# EAGLE design lm317 (EAGLE 9.5.0)
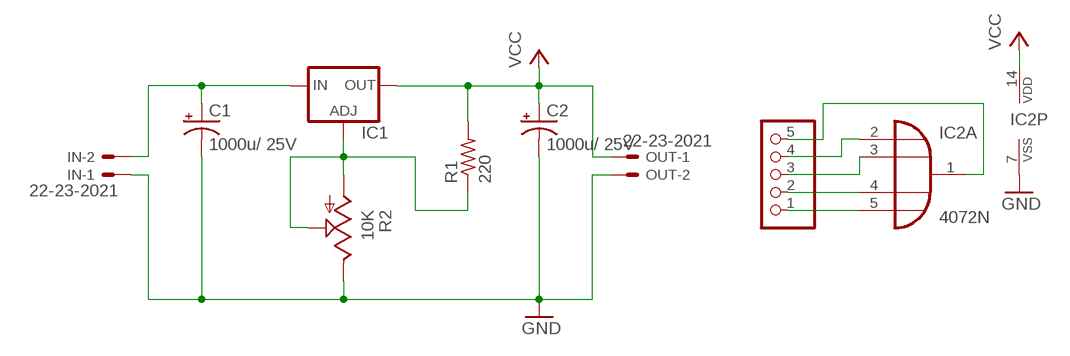
[diagram p0: schematic, sheet 1]

## Parts
C1  1000u/ 25V  CPOL-USE5-8.5  [E5-8,5]
C2  1000u/ 25V  CPOL-USE5-8.5  [E5-8,5]
IC1  LM317TS  [317TS]
IC2  4072N  [DIL14]
IN  22-23-2021  [22-23-2021]
JP1  PINHD-1X5  [1X05]
OUT  22-23-2021  [22-23-2021]
R1  220  R-US_0207/10  [0207/10]
R2  10K  TRIM_US-CA6V  [CA6V]

## Nets
GND: C1.- C2.- IC2.7(P:VSS) IN.1 OUT.2 R2.E
N$1: C1.+ IC1.3(IN) IN.2
N$2: IC2.1(A:O) JP1.5
N$3: IC1.1(ADJ) R1.1 R2.A R2.S
N$4: IC2.2(A:I0) JP1.4
N$5: IC2.3(A:I1) JP1.3
N$6: IC2.4(A:I2) JP1.2
N$7: IC2.5(A:I3) JP1.1
VCC: C2.+ IC1.2(OUT) IC2.14(P:VDD) OUT.1 R1.2
Unconnected: IC2.9(B:I0) IC2.10(B:I1) IC2.11(B:I2) IC2.12(B:I3) IC2.13(B:O)

## Library data of the parts
C1 C2 = rcl:CPOL-US: POLARIZED CAPACITOR, American symbol; SPICEPREFIX: C
IC1 = v-reg:LM317TS: VOLTAGE REGULATOR
IC2 = 40xx:4072: Dual 4-input OR
IN OUT = con-molex:22-23-2021: .100" (2.54mm) Center Header - 2 Pin; MF: MOLEX; MPN: 22-23-2021; OC_FARNELL: 1462926; OC_NEWARK: 25C3832
JP1 = pinhead:PINHD-1X5: PIN HEADER
R1 = rcl:R-US_: RESISTOR, American symbol; SPICEPREFIX: R
R2 = pot:TRIM_US-: POTENTIOMETER

## Board
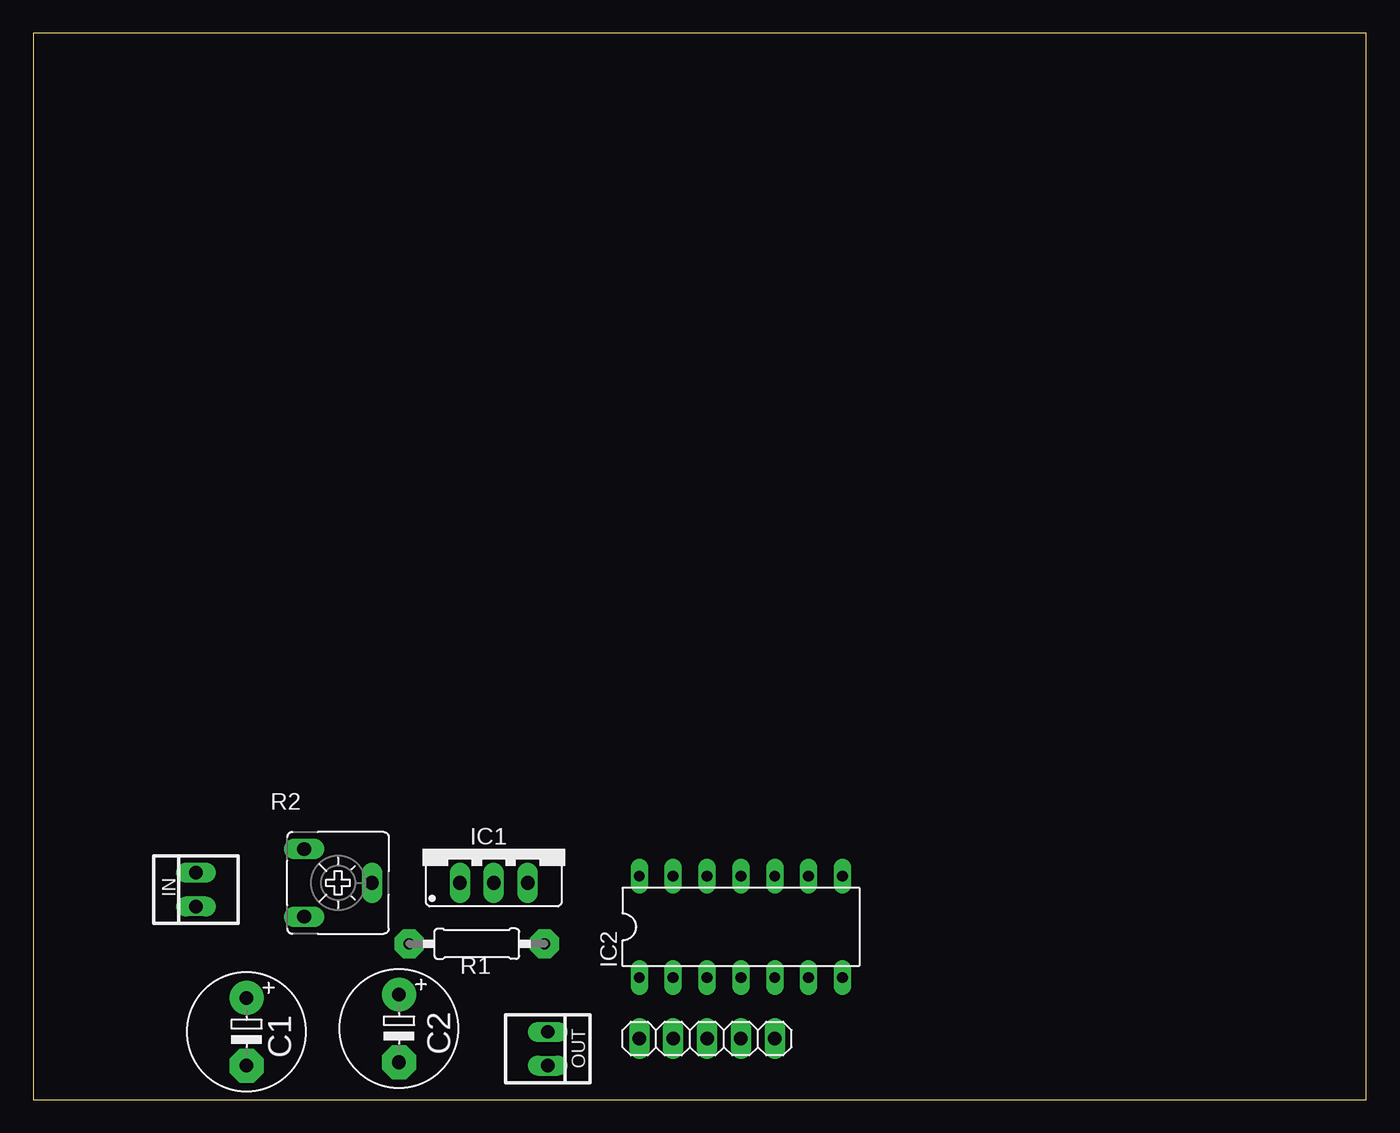
[diagram p1: board, top side]
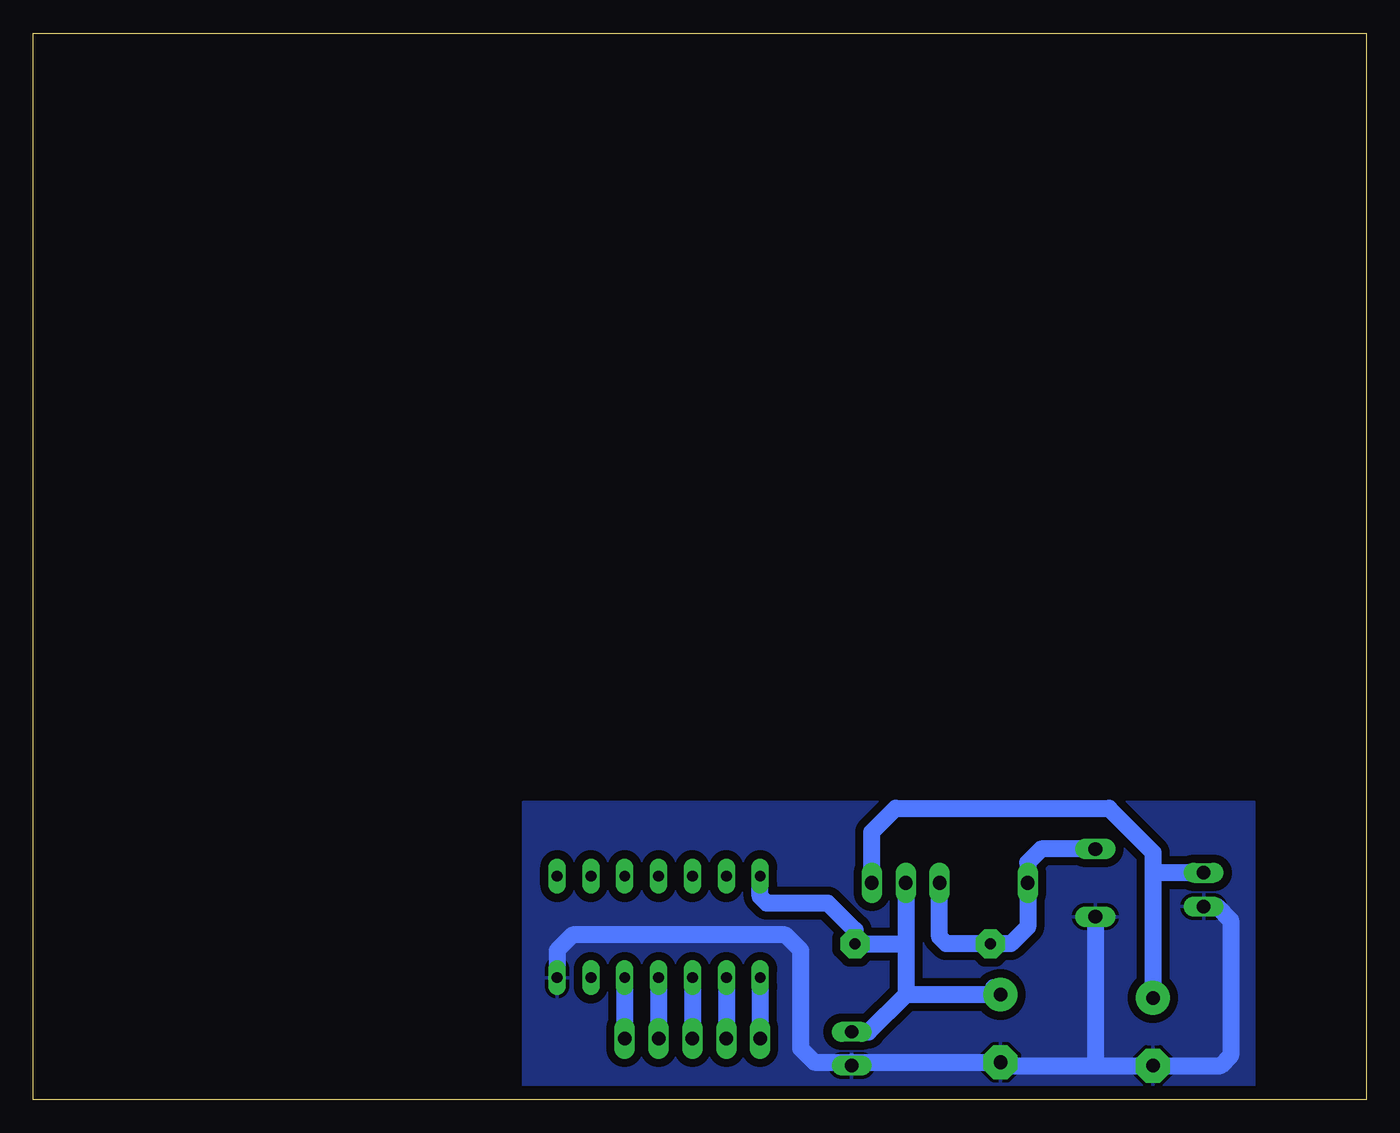
[diagram p2: board, bottom side, seen from below]

Size 100 x 80 mm. Coordinates in mm from the lower left corner, seen from the top.
Outline: 0,0 100,0 100,80 0,80 0,0
Copper layers (1*16): Top 0.035mm / dielectric 1.5mm / Bottom 0.035mm
Design rules "default": minimum track width 6mil, minimum drill 0.35mm, track to track 24mil, track to pad 24mil, pad to pad 24mil, via to via 24mil, smd to smd 24mil, copper to edge 40mil, drill to drill 6mil, minimum pad ring 10mil, minimum via ring 8mil, stop-mask expansion 4mil, vias tented up to drill 0mil, thermal gap 10mil

### Footprints (pad centres in the part's own frame; a part is rotated, then mirrored left to right if it is on the bottom)
E5-8,5 = drill 1.016 pad 2.54: + -2.54,0 | drill 1.016 pad 2.54 octagon: - 2.54,0
317TS = drill 1.016 long: 1 -2.54,-2.54; 2 0,-2.54; 3 2.54,-2.54
DIL14 = drill 0.813 long: 1 -7.62,-3.81; 2 -5.08,-3.81; 3 -2.54,-3.81; 4 0,-3.81; 5 2.54,-3.81; 6 5.08,-3.81; 7 7.62,-3.81; 8 7.62,3.81; 9 5.08,3.81; 10 2.54,3.81; 11 0,3.81; 12 -2.54,3.81; 13 -5.08,3.81; 14 -7.62,3.81
22-23-2021 = drill 1 long: 1 -1.27,0; 2 1.27,0
1X05 = drill 1.016 long: 1 -5.08,0; 2 -2.54,0; 3 0,0; 4 2.54,0; 5 5.08,0
0207/10 = drill 0.813 pad 2.184 octagon: 1 -5.08,0; 2 5.08,0
CA6V = drill 1.016 long: A -2.54,-2.54; E 2.54,-2.54; S 0,2.54

### Placement (x,y rotation side)
C1  16,5.08 270 top
C2  27.43,5.33 270 top
IC1  34.54,18.8 0 top
IC2  53.09,12.95 0 top
IN  12.19,15.75 90 top
JP1  50.55,4.57 180 top
OUT  38.61,3.81 270 top
R1  33.27,11.68 0 top
R2  22.86,16.26 270 top

### Tracks (layer width: path | path; a pad name or v marks a point on that pad's centre or on a via)
GND
  Bottom 1.27: IN.1 11.18,14.48 10.16,13.46 10.16,3.3 10.92,2.54 C1.- 20.07,2.54 | 20.07,2.54 27.18,2.54 C2.- 38.61,2.79 | 38.61,2.79 41.4,2.79 42.42,3.81 42.42,11.18 43.59,12.34 59.54,12.34 60.71,11.18 IC2.7 | 19.68,13.72 R2.E 20.32,2.79 20.07,2.54 | OUT.2 38.61,2.79
  pour Bottom: 8.38,22.35 8.38,0 63.25,0 63.25,22.35
N$1
  Bottom 1.27: IC1.3 37.08,20.07 35.31,21.84 19.3,21.84 16,18.54 16,17.02 | 16,17.02 C1.+ | IN.2 16,17.02
N$2
  Bottom 1.27: IC2.1 JP1.5
N$3
  Bottom 1.27: IC1.1 32,12.19 31.5,11.68 R1.1 26.67,11.68 25.4,12.95 R2.S 25.4,17.78 24.38,18.8 R2.A
N$4
  Bottom 1.27: IC2.2 JP1.4
N$5
  Bottom 1.27: IC2.3 JP1.3
N$6
  Bottom 1.27: IC2.4 JP1.2
N$7
  Bottom 1.27: IC2.5 JP1.1
VCC
  Bottom 1.27: 27.94,8.38 C2.+ 34.54,7.87 | OUT.1 37.34,5.08 34.54,7.87 | IC1.2 34.54,11.68 | 34.54,11.68 34.54,7.87 | 34.54,11.68 R1.2 38.35,12.7 40.39,14.73 44.96,14.73 45.47,15.24 IC2.14